# Altium project STC_Simple.PrjPcb
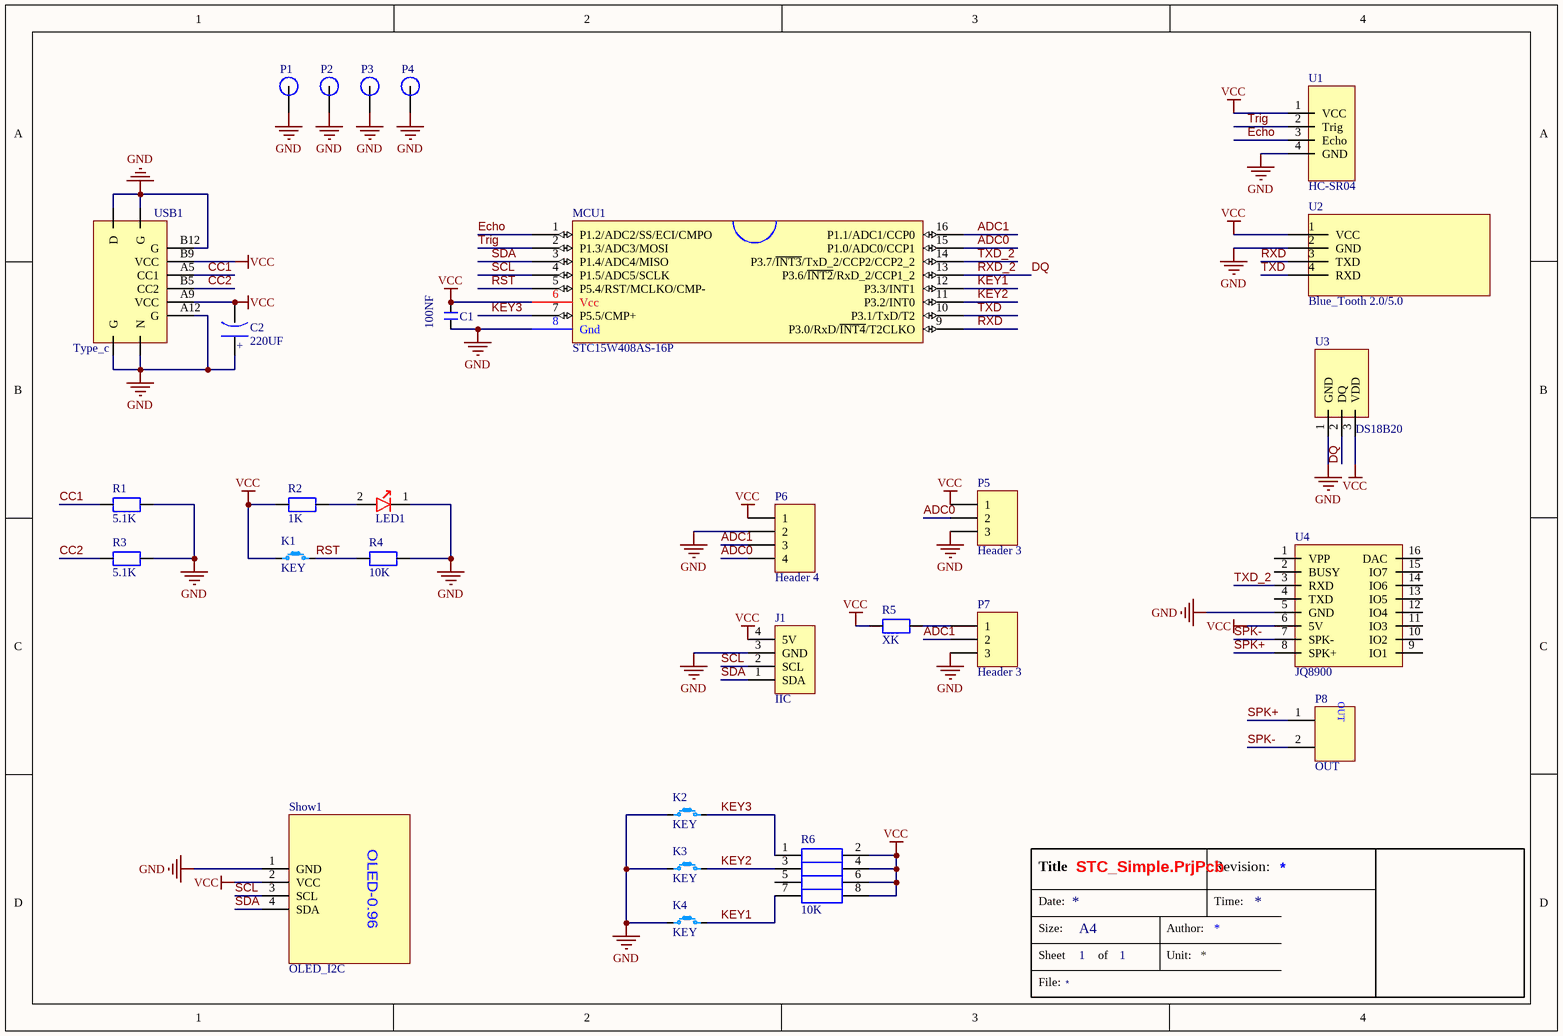
[diagram p0: Sheet.SchDoc]
1 sheet, 29 parts. Net scope: global (net labels, ports and power ports of the same name join across sheets).
Board file: PCB.PcbDoc

## Sheet Sheet.SchDoc
size A4; SheetNumber: 1; SheetTotal: 1

### Parts
C1  100NF  [CAP_0603]
C2  220UF  [CAP_PR_2.5_6.3_RA]
J1  IIC  [IIC-XH2.54-4PIN]
K1  KEY  [KEY_SMD]
K2  KEY  [SW_PB_3X6]
K3  KEY  [SW_PB_3X6]
K4  KEY  [SW_PB_3X6]
LED1  LED_R/G/B/Y  [LED_0603_R]  (value not drawn)
MCU1  STC15W408AS-16P  [SOIC_16]
P1  铜柱6m  [M3x6_L-Type]  (value not drawn)
P2  铜柱6m  [M3x6_L-Type]  (value not drawn)
P3  铜柱6m  [M3x6_L-Type]  (value not drawn)
P4  铜柱6m  [M3x6_L-Type]  (value not drawn)
P5  Header 3  [Header 2.54X3]
P6  Header 4  [Header F 2.54X4]
P7  Header 3  [Header 2.54X3]
P8  OUT  [XH2.54-WI-2P]
R1  5.1K  [RESC_0603_2]
R2  1K  [RESC_0603_2]
R3  5.1K  [RESC_0603_2]
R4  10K  [RESC_0603_2]
R5  XK  [RESC_0603_2]
R6  10K  [RESC_0603_4]
Show1  OLED_I2C  [OLED_I2C]
U1  HC-SR04  [Ultrasonic]
U2  Blue_Tooth 2.0/5.0  [uart-Haerd]
U3  DS18B20  [TO_92B]
U4  JQ8900  [SpkMo]
USB1  Type_c  [USB-Type-c_6P]

### Nets
GND: C1.1 C2.1 J1.3(GND) K2.2 K3.2 K4.2 LED1.1(-) MCU1.8(Gnd) P1.1(IO) P2.1(IO) P3.1(IO) P4.1(IO) P5.3 P6.2 P7.3 R1.2 R3.2 R4.2 Show1.1(GND) U1.4(GND) U2.2(GND) U3.1(GND) U4.5(GND) USB1.A(G) USB1.A12(G) USB1.B(N) USB1.B12(G) USB1.C(D) USB1.D(G)
VCC: C1.2 C2.2 J1.4(5V) K1.2 MCU1.6(Vcc) P5.1 P6.1 R2.1 R5.1 R6.2 R6.4 R6.6 R6.8 Show1.2(VCC) U1.1(VCC) U2.1(VCC) U3.3(VDD) U4.6(5V) USB1.A9(VCC) USB1.B9(VCC)
ADC0: MCU1.15(P1.0/ADC0/CCP1) P5.2 P6.4
ADC1: MCU1.16(P1.1/ADC1/CCP0) P6.3 P7.2
CC1: R1.1 USB1.A5(CC1)
CC2: R3.1 USB1.B5(CC2)
DQ: MCU1.13(P3.6/~{INT2}/RxD_2/CCP1_2) U3.2(DQ)  [also labelled RXD_2]
Echo: MCU1.1(P1.2/ADC2/SS/ECI/CMPO) U1.3(Echo)
KEY1: K4.1 MCU1.12(P3.3/INT1) R6.7
KEY2: K3.1 MCU1.11(P3.2/INT0) R6.3
KEY3: K2.1 MCU1.7(P5.5/CMP+) R6.1
RST: K1.1 MCU1.5(P5.4/RST/MCLKO/CMP-) R4.1
RXD: MCU1.9(P3.0/RxD/~{INT4}/T2CLKO) U2.3(TXD)
SCL: J1.2(SCL) MCU1.4(P1.5/ADC5/SCLK) Show1.3(SCL)
SDA: J1.1(SDA) MCU1.3(P1.4/ADC4/MISO) Show1.4(SDA)
SPK+: P8.1 U4.8(SPK+)
SPK-: P8.2 U4.7(SPK-)
Trig: MCU1.2(P1.3/ADC3/MOSI) U1.2(Trig)
TXD: MCU1.10(P3.1/TxD/T2) U2.4(RXD)
TXD_2: MCU1.14(P3.7/~{INT3}/TxD_2/CCP2/CCP2_2) U4.3(RXD)
NetLED1_2: LED1.2(+) R2.2
NetP7_1: P7.1 R5.2

Not connected (* = marked no-connect by the designer): R6 5; U4 1(VPP) 2(BUSY) 4(TXD) 9(IO1) 10(IO2) 11(IO3) 12(IO4) 13(IO5) 14(IO6) 15(IO7) 16(DAC)

### Notes on the sheet
- Title
- Date:
- Revision:
- Time:
- File:
- Size:
- Sheet
- A4
- of
- Author:
- Unit:
- (in symbol CAP_BIG) +
- (in symbol OLED_I2C) OLED-0.96

### Library data of the parts
C1 = CAP: CAP  12~50V
C2 = CAP_BIG: CAP 12V ~ 50V   电解电容
J1 = IIC: Heard
LED1 = LED_SMT: LED
MCU1 = STC15W-16: MCU
P1-P4 = Pillar: IN-OUT
P5 P7 = Header 3: Header, 3-Pin; LatestRevisionDate: 17-Jul-2002; LatestRevisionNote: Re-released for DXP Platform.; Publisher: Altium Limited
P6 = Header 4: Header, 4-Pin; LatestRevisionDate: 17-Jul-2002; LatestRevisionNote: Re-released for DXP Platform.; Publisher: Altium Limited
P8 = OUT_2PIN: Header
R1-R5 = RES: RES 贴片
R6 = RES_P4: RES
Show1 = OLED_I2C: MODE
U1 = Ultrasonic: Mode
U2 = HC-02/06: MODE
U3 = DS18B20: MODE
U4 = SPKMO_8900: MODE
USB1 = USB-Type_c-6PIn: USB